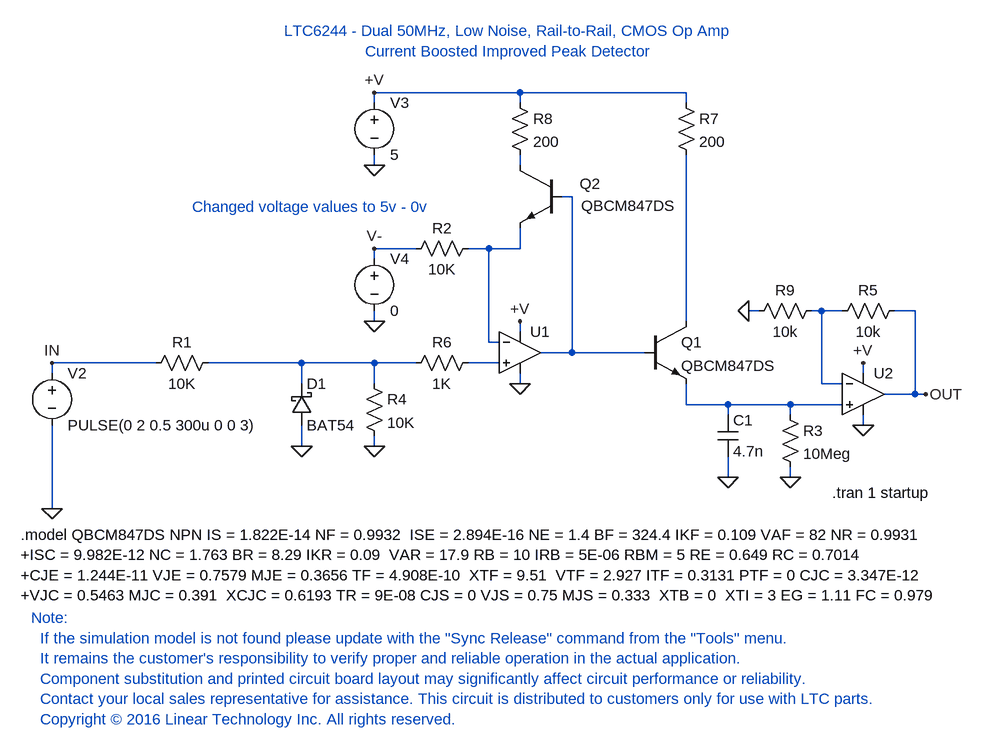
[diagram p0: schematic phototransistor-peak.asc]
phototransistor-peak.asc, the LTspice schematic file:
Version 4
SHEET 1 1036 1712
WIRE -1360 320 -1584 320
WIRE -1104 320 -1360 320
WIRE -1584 336 -1584 320
WIRE -1360 336 -1360 320
WIRE -1104 336 -1104 320
WIRE -1584 432 -1584 416
WIRE -1360 432 -1360 416
WIRE -1280 480 -1296 480
WIRE -1520 560 -1584 560
WIRE -1408 560 -1440 560
WIRE -1360 560 -1360 528
WIRE -1360 560 -1408 560
WIRE -1584 576 -1584 560
WIRE -992 656 -1008 656
WIRE -896 656 -912 656
WIRE -864 656 -896 656
WIRE -752 656 -784 656
WIRE -1584 672 -1584 656
WIRE -1104 672 -1104 416
WIRE -1360 688 -1360 672
WIRE -1408 704 -1408 560
WIRE -1392 704 -1408 704
WIRE -1280 720 -1280 480
WIRE -1280 720 -1328 720
WIRE -1168 720 -1280 720
WIRE -1920 736 -2080 736
WIRE -1696 736 -1840 736
WIRE -1584 736 -1696 736
WIRE -1520 736 -1584 736
WIRE -1392 736 -1440 736
WIRE -2080 752 -2080 736
WIRE -832 752 -832 736
WIRE -1696 768 -1696 736
WIRE -1584 768 -1584 736
WIRE -1360 768 -1360 752
WIRE -896 768 -896 656
WIRE -864 768 -896 768
WIRE -752 784 -752 656
WIRE -752 784 -800 784
WIRE -736 784 -752 784
WIRE -1104 800 -1104 768
WIRE -1040 800 -1104 800
WIRE -944 800 -1040 800
WIRE -864 800 -944 800
WIRE -1040 816 -1040 800
WIRE -944 816 -944 800
WIRE -832 832 -832 816
WIRE -1696 864 -1696 832
WIRE -1584 864 -1584 848
WIRE -1040 912 -1040 880
WIRE -944 912 -944 896
WIRE -2080 960 -2080 832
FLAG -1360 768 0
FLAG -2080 960 0
FLAG -1696 864 0
FLAG -1584 864 0
FLAG -1040 912 0
FLAG -944 912 0
FLAG -832 832 0
FLAG -736 784 OUT
FLAG -2080 736 IN
FLAG -1584 672 0
FLAG -1584 320 +V
FLAG -1584 560 V-
FLAG -1584 432 0
FLAG -832 736 +V
FLAG -1360 672 +V
FLAG -1008 656 0
SYMBOL res -1936 752 R270
WINDOW 0 32 56 VTop 2
WINDOW 3 0 56 VBottom 2
SYMATTR InstName R1
SYMATTR Value 10K
SYMBOL cap -1056 816 R0
SYMATTR InstName C1
SYMATTR Value 4.7n
SYMBOL res -1424 544 R90
WINDOW 0 0 56 VBottom 2
WINDOW 3 32 56 VTop 2
SYMATTR InstName R2
SYMATTR Value 10K
SYMBOL res -960 800 R0
SYMATTR InstName R3
SYMATTR Value 10Meg
SYMBOL schottky -1712 832 M180
WINDOW 0 24 64 Left 2
WINDOW 3 24 0 Left 2
SYMATTR InstName D1
SYMATTR Value BAT54
SYMATTR Description Diode
SYMATTR Type diode
SYMBOL res -1600 752 R0
SYMATTR InstName R4
SYMATTR Value 10K
SYMBOL res -1536 752 R270
WINDOW 0 32 56 VTop 2
WINDOW 3 0 56 VBottom 2
SYMATTR InstName R6
SYMATTR Value 1K
SYMBOL voltage -2080 736 R0
WINDOW 123 0 0 Left 2
WINDOW 39 0 0 Left 2
SYMATTR InstName V2
SYMATTR Value PULSE(0 2 0.5 300u 0 0 3)
SYMBOL npn -1168 672 R0
SYMATTR InstName Q1
SYMATTR Value QBCM847DS
SYMBOL npn -1296 432 M0
WINDOW 3 -30 62 Right 2
WINDOW 0 -28 28 Right 2
SYMATTR Value QBCM847DS
SYMATTR InstName Q2
SYMBOL res -1120 320 R0
SYMATTR InstName R7
SYMATTR Value 200
SYMBOL res -1376 320 R0
SYMATTR InstName R8
SYMATTR Value 200
SYMBOL voltage -1584 320 R0
WINDOW 123 0 0 Left 2
WINDOW 39 0 0 Left 2
SYMATTR InstName V3
SYMATTR Value 5
SYMBOL voltage -1584 560 R0
WINDOW 123 0 0 Left 2
WINDOW 39 0 0 Left 2
SYMATTR InstName V4
SYMATTR Value 0
SYMBOL Opamps\\UniversalOpamp2 -1360 720 R0
SYMATTR InstName U1
SYMBOL Opamps\\UniversalOpamp2 -832 784 R0
SYMATTR InstName U2
SYMBOL res -768 640 R90
WINDOW 0 0 56 VBottom 2
WINDOW 3 32 56 VTop 2
SYMATTR InstName R5
SYMATTR Value 10k
SYMBOL res -896 640 R90
WINDOW 0 0 56 VBottom 2
WINDOW 3 32 56 VTop 2
SYMATTR InstName R9
SYMATTR Value 10k
TEXT -880 936 Left 2 !.tran 1 startup
TEXT -2128 1000 Left 2 !.model QBCM847DS NPN IS = 1.822E-14 NF = 0.9932  ISE = 2.894E-16 NE = 1.4 BF = 324.4 IKF = 0.109 VAF = 82 NR = 0.9931 \n+ISC = 9.982E-12 NC = 1.763 BR = 8.29 IKR = 0.09  VAR = 17.9 RB = 10 IRB = 5E-06 RBM = 5 RE = 0.649 RC = 0.7014 \n+CJE = 1.244E-11 VJE = 0.7579 MJE = 0.3656 TF = 4.908E-10  XTF = 9.51  VTF = 2.927 ITF = 0.3131 PTF = 0 CJC = 3.347E-12 \n+VJC = 0.5463 MJC = 0.391  XCJC = 0.6193 TR = 9E-08 CJS = 0 VJS = 0.75 MJS = 0.333  XTB = 0  XTI = 3 EG = 1.11 FC = 0.979
TEXT -1376 272 Bottom 2 ;LTC6244 - Dual 50MHz, Low Noise, Rail-to-Rail, CMOS Op Amp\nCurrent Boosted Improved Peak Detector
TEXT -2112 1128 Left 2 ;Note:\n  If the simulation model is not found please update with the "Sync Release" command from the "Tools" menu.\n  It remains the customer's responsibility to verify proper and reliable operation in the actual application.\n  Component substitution and printed circuit board layout may significantly affect circuit performance or reliability.\n  Contact your local sales representative for assistance. This circuit is distributed to customers only for use with LTC parts.\n  Copyright © 2016 Linear Technology Inc. All rights reserved.
TEXT -1864 496 Left 2 ;Changed voltage values to 5v - 0v

The netlist it stands for:
* phototransistor-peak.asc
R1 IN N006 10K
C1 N008 0 4.7n
R2 N003 V- 10K
R3 N008 0 10Meg
D1 0 N006 BAT54
R4 N006 0 10K
R6 N006 N007 1K
V2 IN 0 PULSE(0 2 0.5 300u 0 0 3)
Q1 N005 N002 N008 0 QBCM847DS
Q2 N001 N002 N003 0 QBCM847DS
R7 +V N005 200
R8 +V N001 200
V3 +V 0 5
V4 V- 0 0
XU1 N007 N003 +V 0 N002 level.2 Avol=1Meg GBW=10Meg Slew=10Meg ilimit=25m rail=0 Vos=0 phimargin=45 en=0 enk=0 in=0 ink=0 Rin=500Meg  ; pins IN+ IN- V+ V- OUT
XU2 N008 N004 +V 0 OUT level.2 Avol=1Meg GBW=10Meg Slew=10Meg ilimit=25m rail=0 Vos=0 phimargin=45 en=0 enk=0 in=0 ink=0 Rin=500Meg  ; pins IN+ IN- V+ V- OUT
R5 OUT N004 10k
R9 N004 0 10k
.model D D
.lib standard.dio
.model NPN NPN
.model PNP PNP
.lib standard.bjt
.tran 1 startup
.model QBCM847DS NPN IS = 1.822E-14 NF = 0.9932  ISE = 2.894E-16 NE = 1.4 BF = 324.4 IKF = 0.109 VAF = 82 NR = 0.9931
+ISC = 9.982E-12 NC = 1.763 BR = 8.29 IKR = 0.09  VAR = 17.9 RB = 10 IRB = 5E-06 RBM = 5 RE = 0.649 RC = 0.7014
+CJE = 1.244E-11 VJE = 0.7579 MJE = 0.3656 TF = 4.908E-10  XTF = 9.51  VTF = 2.927 ITF = 0.3131 PTF = 0 CJC = 3.347E-12
+VJC = 0.5463 MJC = 0.391  XCJC = 0.6193 TR = 9E-08 CJS = 0 VJS = 0.75 MJS = 0.333  XTB = 0  XTI = 3 EG = 1.11 FC = 0.979
* LTC6244 - Dual 50MHz, Low Noise, Rail-to-Rail, CMOS Op Amp
* Current Boosted Improved Peak Detector
* Note:
*   If the simulation model is not found please update with the "Sync Release" command from the "Tools" menu.
*   It remains the customer's responsibility to verify proper and reliable operation in the actual application.
*   Component substitution and printed circuit board layout may significantly affect circuit performance or reliability.
*   Contact your local sales representative for assistance. This circuit is distributed to customers only for use with LTC parts.
*   Copyright © 2016 Linear Technology Inc. All rights reserved.
* Changed voltage values to 5v - 0v
.lib UniversalOpamps2.sub
.backanno
.end